# Altium schematic sheet 2d_list_1.schdoc
size 420 x 594 mm; DocumentNumber: МИЭТ
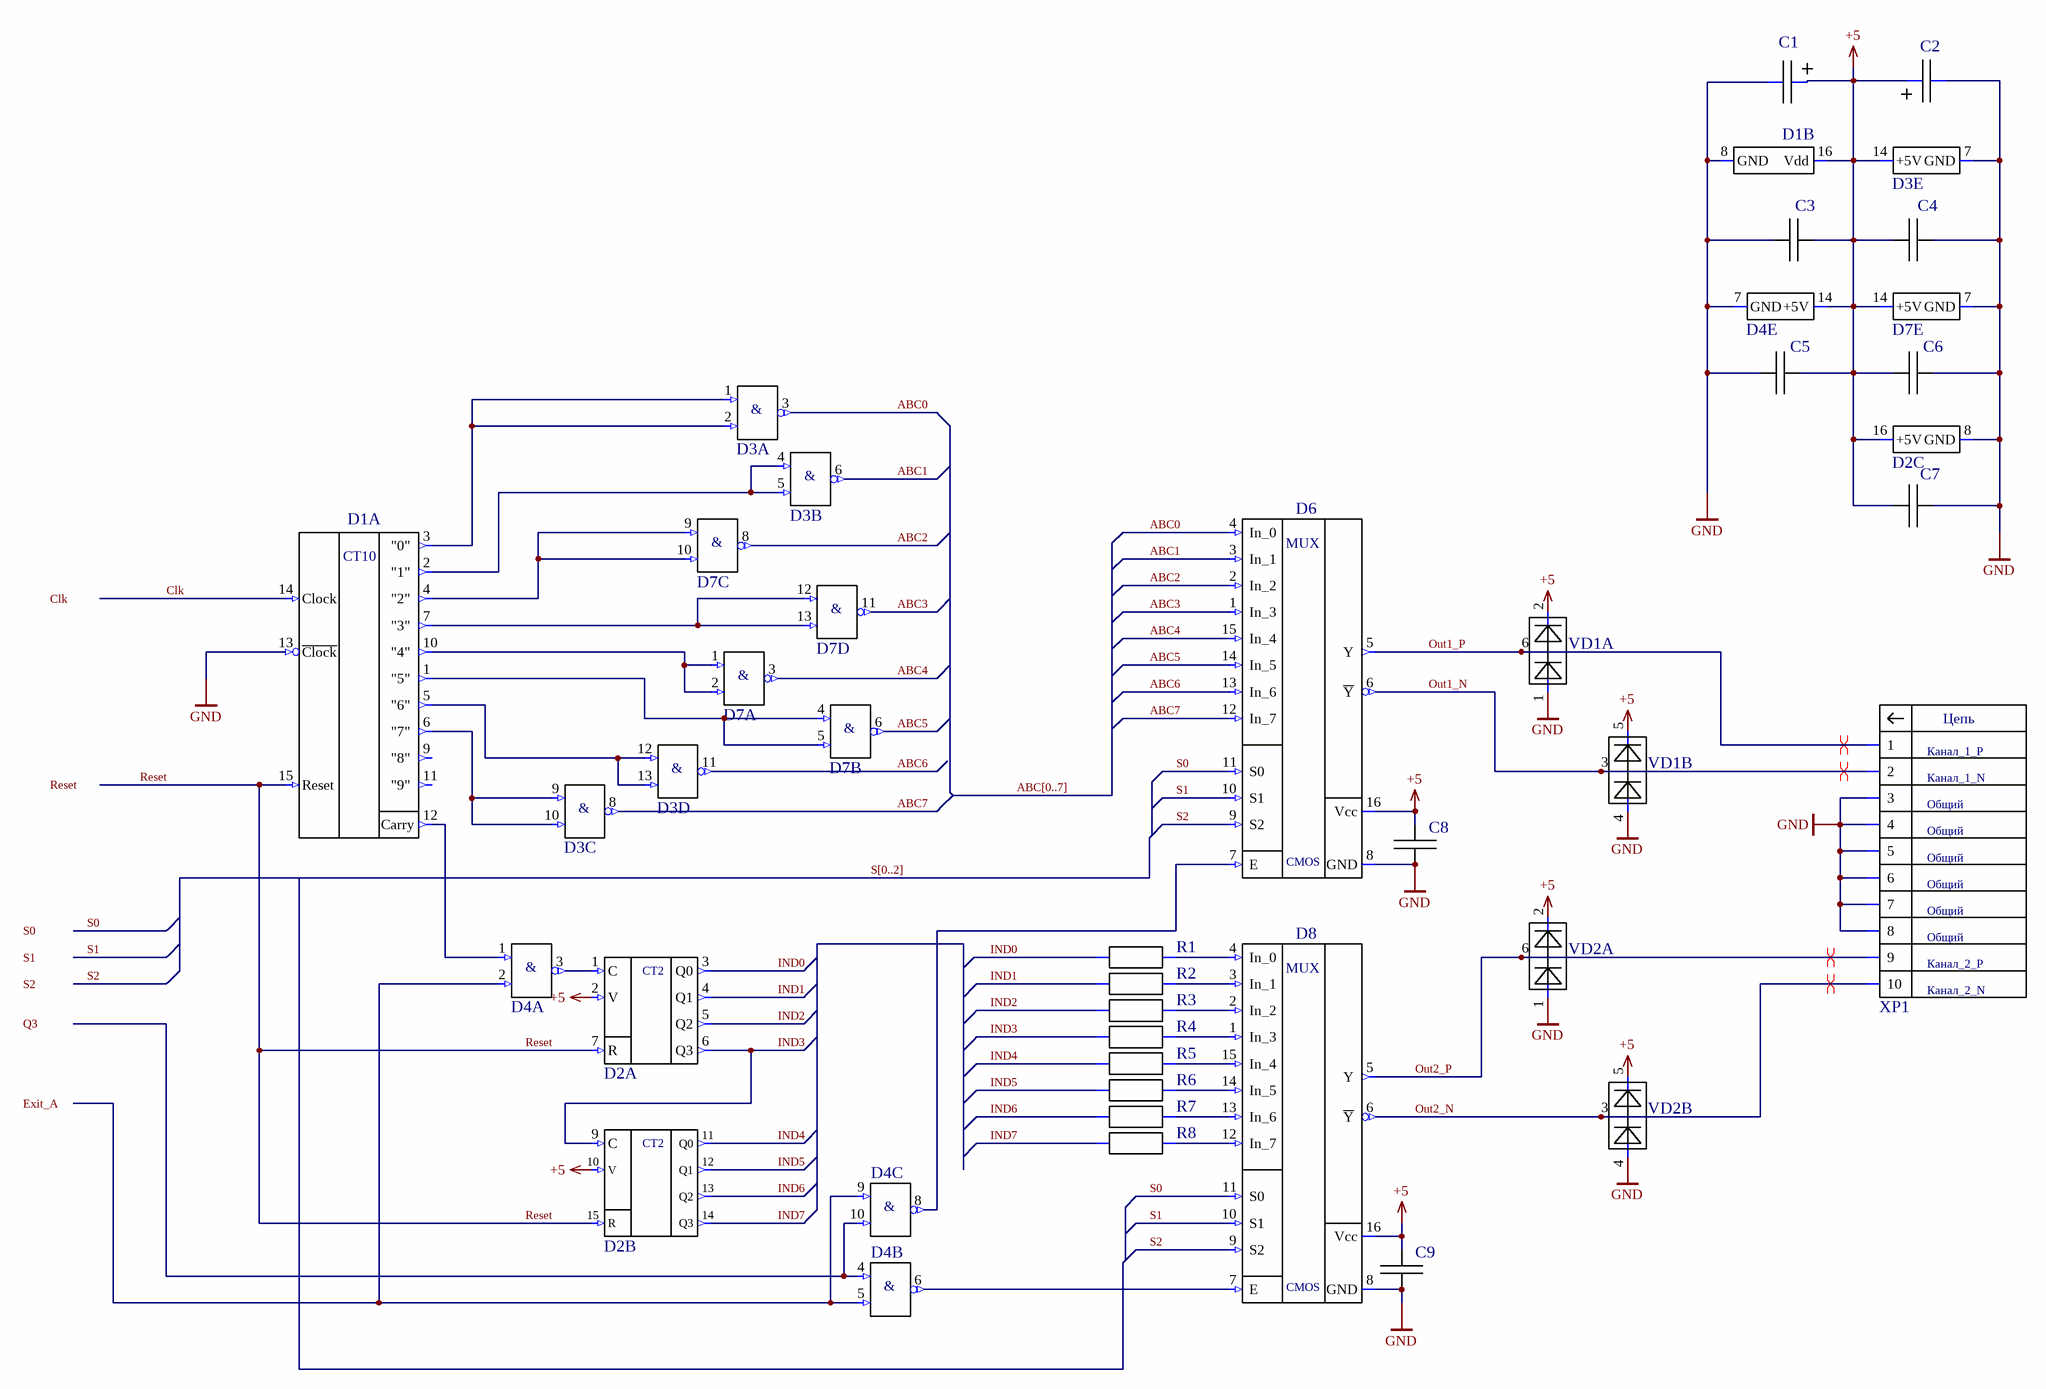
[diagram p0: 2d_list_1.schdoc]

## Parts
C1  C  [C-Tantal]  (value not drawn)
C2  C  [C-Tantal]  (value not drawn)
C3  1206  [K10-79_3.2_1.6(1206)]  (value not drawn)
C4  1206  [K10-79_3.2_1.6(1206)]  (value not drawn)
C5  1206  [K10-79_3.2_1.6(1206)]  (value not drawn)
C6  1206  [K10-79_3.2_1.6(1206)]  (value not drawn)
C7  1206  [K10-79_3.2_1.6(1206)]  (value not drawn)
C8  1206  [K10-79_3.2_1.6(1206)]  (value not drawn)
C9  1206  [K10-79_3.2_1.6(1206)]  (value not drawn)
D1  DIP-16  [DIP16]  (value not drawn)  (parts A,B of 2)
D2  (no value)  [DIP16]  (parts A,B,C of 3)
D3  74AC00PC  [DIP14]  (value not drawn)  (parts A,B,C,D,E of 5)
D4  74AC00PC  [DIP14]  (value not drawn)  (parts A,B,C,E of 5)
D6  DIP-16  [DIP16]  (value not drawn)
D7  74AC00PC  [DIP14]  (value not drawn)  (parts A,B,C,D,E of 5)
D8  DIP-16  [DIP16]  (value not drawn)
R1  (no value)  [RES_0603_1608_N]
R2  (no value)  [RES_0603_1608_N]
R3  (no value)  [RES_0603_1608_N]
R4  (no value)  [RES_0603_1608_N]
R5  (no value)  [RES_0603_1608_N]
R6  (no value)  [RES_0603_1608_N]
R7  (no value)  [RES_0603_1608_N]
R8  (no value)  [RES_0603_1608_N]
VD1  SOT-363  [SOT363_NXP]  (value not drawn)  (parts A,B of 2)
VD2  SOT-363  [SOT363_NXP]  (value not drawn)  (parts A,B of 2)
XP1  TE_1-1634689-0  [BH-10R]  (value not drawn)

## Ports
Clk, Exit_A, Q3, Reset, S0, S1, S2

## Nets
+5: C1.+ C2.+ C3.2 C4.1 C5.2 C6.1 C7.1 C8.1 C9.1 D1.16(Vdd) D2.2(V) D2.10(V) D2.16(+5V) D3.14(+5V) D4.14(+5V) D6.16(Vcc) D7.14(+5V) D8.16(Vcc) VD1.2(K2) VD1.5(K4) VD2.2(K2) VD2.5(K4)
GND: C1.- C2.- C3.1 C4.2 C5.1 C6.2 C7.2 C8.2 C9.2 D1.8(GND) D1.13(~{Clock}) D2.8(GND) D3.7(GND) D4.7(GND) D6.8(GND) D7.7(GND) D8.8(GND) VD1.1(A1) VD1.4(A3) VD2.1(A1) VD2.4(A3) XP1.3 XP1.4 XP1.5 XP1.6 XP1.7 XP1.8
ABC0: D3.3(Out) D6.4(In_0)
ABC1: D3.6(Out) D6.3(In_1)
ABC2: D6.2(In_2) D7.8(Out)
ABC3: D6.1(In_3) D7.11(Out)
ABC4: D6.15(In_4) D7.3(Out)
ABC5: D6.14(In_5) D7.6(Out)
ABC6: D3.11(Out) D6.13(In_6)
ABC7: D3.8(Out) D6.12(In_7)
Clk: D1.14(Clock) ; port Clk
Exit_A: D4.2(In2) D4.5(In2) D4.9(In1) ; port Exit_A
IND0: D2.3(Q0) R1.1
IND1: D2.4(Q1) R2.1
IND2: D2.5(Q2) R3.1
IND3: D2.6(Q3) D2.9(C) R4.1
IND4: D2.11(Q0) R5.1
IND5: D2.12(Q1) R6.1
IND6: D2.13(Q2) R7.1
IND7: D2.14(Q3) R8.1
Out1_N: D6.6(~{Y}) VD1.3(K3A4) XP1.2
Out1_P: D6.5(Y) VD1.6(K1A2) XP1.1
Out2_N: D8.6(~{Y}) VD2.3(K3A4) XP1.10
Out2_P: D8.5(Y) VD2.6(K1A2) XP1.9
Q3: D4.4(In1) D4.10(In2) ; port Q3
Reset: D1.15(Reset) D2.7(R) D2.15(R) ; port Reset
S0: D6.11(S0) D8.11(S0) ; port S0
S1: D6.10(S1) D8.10(S1) ; port S1
S2: D6.9(S2) D8.9(S2) ; port S2
NetD1_1: D1.1("5") D7.4(In1) D7.5(In2)
NetD1_2: D1.2("1") D3.4(In1) D3.5(In2)
NetD1_3: D1.3("0") D3.1(In1) D3.2(In2)
NetD1_4: D1.4("2") D7.9(In1) D7.10(In2)
NetD1_5: D1.5("6") D3.12(In1) D3.13(In2)
NetD1_6: D1.6("7") D3.9(In1) D3.10(In2)
NetD1_7: D1.7("3") D7.12(In1) D7.13(In2)
NetD1_10: D1.10("4") D7.1(In1) D7.2(In2)
NetD1_12: D1.12(Carry) D4.1(In1)
NetD2_1: D2.1(C) D4.3(Out)
NetD4_6: D4.6(Out) D8.7(E)
NetD4_8: D4.8(Out) D6.7(E)
NetD8_1: D8.1(In_3) R4.2
NetD8_2: D8.2(In_2) R3.2
NetD8_3: D8.3(In_1) R2.2
NetD8_4: D8.4(In_0) R1.2
NetD8_12: D8.12(In_7) R8.2
NetD8_13: D8.13(In_6) R7.2
NetD8_14: D8.14(In_5) R6.2
NetD8_15: D8.15(In_4) R5.2

Not connected (* = marked no-connect by the designer): D1 9("8") 11("9")

## Buses and harness runs
bus ABC[0..7]
bus S[0..2]

## Layout directives
differential pair: Out1_N, Out1_P, Out2_N, Out2_P

## Notes on the sheet
- (near XP1) Канал_1_P
- (near XP1) Канал_1_N
- (near XP1) Общий
- (near XP1) Канал_2_P
- (near XP1) Канал_2_N
- Перв. примен.
- Справ. №
- Подп. дата
- Инв. № дубл.
- Взам. инв. №
- Подп. и дата
- Изм.
- Разраб.
- Лист
- № докум.
- Подп.
- Дата
- Лит.
- Масса
- Масштаб
- Пров.
- Т.контр.
- Листов
- Инв. № подл.
- Н.контр.
- Утв.
- ALTIUM GOSTBOM2.0 KEV
- Файл:
- Копировал
- Формат А2
- (in symbol 74AC00PC, part A) &
- (in symbol 74AC00PC, part B) &
- (in symbol 74AC00PC, part C) &
- (in symbol 74AC00PC, part D) &
- (in symbol 74HC151N) MUX; CMOS
- (in symbol HCF4017BEY, part A) CT10
- (in symbol MC14520BCP, part A) CT2
- (in symbol MC14520BCP, part B) CT2
- (in symbol TE_1-1634689-0) Цепь

## Library data of the parts
C1 C2 = K53-65_C_10%: К53-65 Конденсатор танталовый C(6032) 0,47-100 мкФ; Manufacturer: ОАО "Элеконд"; TU: АЖЯР.673546.004 ТУ; Tolerance: 10%; Created_by: Желобаев; BOM: К53-65 "C" - *B - *мкФ ±10% АЖЯР.673546.004 ТУ; Name2: Конденсатор К53-65; Value: *; Voltage: *; Weight: 0,3; Version: 0; Issue_date: 6.01.2019; Size: C; Name: К53-65; Case: C
C3-C7 = К10-79_1206_Н90: Чип конденсатор 1206 Н90 ряд Е6; Manufacturer: ООО "Кулон"; Name: Конденсатор К10-79; Reliability: 0.000005; Permit MPSU: разрешен; LiveStatus: производится; Packing: катушка; LibraryEngeneer: Желобаев; Tolerance: +80%-20%; Datum: 19_12_2018; TU: АЖЯР.673511.004 ТУ; Type: K10-79; Hight: 1.6; BOM: Конденсатор К10-79-*-B-*+80%-20%-Н90 АЖЯР.673511.004 ТУ; Version: 00; HelpURL: \\papa\Info\Altium_Library\Даташиты_и_ТУ\Конденсаторы_отечественные\К10-79_АЖЯР_673511_004ТУ.pdf; Weight: 0.15; Voltage: *; TKE: Н90; Size: 1206; Value: *; Value_KD: *
C8 C9 = К10-79_1206_МП0: Чип конденсатор 1206 МП0 ряд Е24; Manufacturer: ООО "Кулон"; Name: Конденсатор К10-79; Reliability: 0.000005; Permit MPSU: разрешен; LiveStatus: производится; Packing: катушка; LibraryEngeneer: Желобаев; Tolerance: ±5%; Datum: 19_12_2018; TU: АЖЯР.673511.004 ТУ; Type: K10-79; Hight: 1.6; BOM: Конденсатор К10-79-*-B-*±5%-МП0 АЖЯР.673511.004 ТУ; Version: 00; HelpURL: \\papa\Info\Altium_Library\Даташиты_и_ТУ\Конденсаторы_отечественные\К10-79_АЖЯР_673511_004ТУ.pdf; Weight: 0.15; Voltage: *; TKE: МП0; Size: 1206; Value: *; Value_KD: *
D1 = HCF4017BEY: Декадный счетчик c 10 декодированными выходами; Manufacturer: STMicroelectronics; Power_Voltage: -0.5 -22 V; BOM: HCF4017BEY "STMicroelectronics"; Created_by: Желобаев; Name2: Микросхема HCF4017BEY; Case: DIP-16; Issue_date: 05.04.2019; Name: HCF4017BEY; Version: 0
D2 = MC14520BCP: Два двоичных счетчика; Manufacturer: Motorola; Created_by: Желобаев; BOM: MC14520BCP "Motorola"; Name2: Микросхема MC14520BCP; Issue_date: 6.01.2019; Version: 0; Name: MC14520BCP; Case: DIP-16
D3 D4 D7 = 74AC00PC: 4 элемента 2И-НЕ TTL PDIP-14; Manufacturer: ON Semiconductor; BOM: 74AC00PC "ON Semiconductor"; Created_by: Желобаев; Power_Voltage: 4.5 - 5.5 V; Name2: Микросхема 74AC00PC; Issue_date: 10.04.2019; Case: DIP-14; Name: 74AC00PC; Version: 0
D6 D8 = 74HC151N: мультиплексор 8 канальный CMOS; Manufacturer: NXP Semiconductors; Power_Voltage: 2.0 -6.0 V; BOM: 74HC151N "NXP Semiconductors"; Created_by: Желобаев; Name2: Микросхема 74HC151N; Case: DIP-16; Issue_date: 05.04.2019; Name: 74HC151N; Version: 0
R1-R8 = Р1-12-0,1-5%: Резистор от 0,75 Ом до 10 МОм; Manufacturer: ОАО "НПО "Эркон"; Tolerance: 5%; TU: АЛЯР.434110.005 ТУ; Voltage: 50; TKR: M; BOM: Р1-12-0,1 * 5%-M-"A" АЛЯР.434110.005 ТУ; Created_by: Желобаев; Name2: Резистор Р1-12-0,1; Version: 00; Type: Р1-12-0,1±5%-М-"А"; Weight: 0,005; Size: 0603; Name: Р1-12-0,1; Value_KD: *; Issue_date: 10.04.2019; Case: 0603
VD1 VD2 = BAV99S: Высокоскоростные, переключающие диоды; Manufacturer: Nexperia; BOM: BAV99S "Nexperia"; Voltage: 100; Created_by: Желобаев; Name2: Диод BAV99S; Version: 0; Name: BAV99S; Case: SOT-363; Issue_date: 07.01.2019
XP1 = TE_1-1634689-0: Вилка типа BH-10R угловая правая двухрядная 2х5х2.54; Manufacturer: TE Connectivity; Created_by: Желобаев; BOM: TE_1-1634689-0 "TE Connectivity"; Name2: Вилка угловая TE_1-1634689-0; Name: TE_1-1634689-0; Issue_date: 13.05.2019; Version: 0; Case: BH-10R